# Altium project gittest23_2.PrjPcb
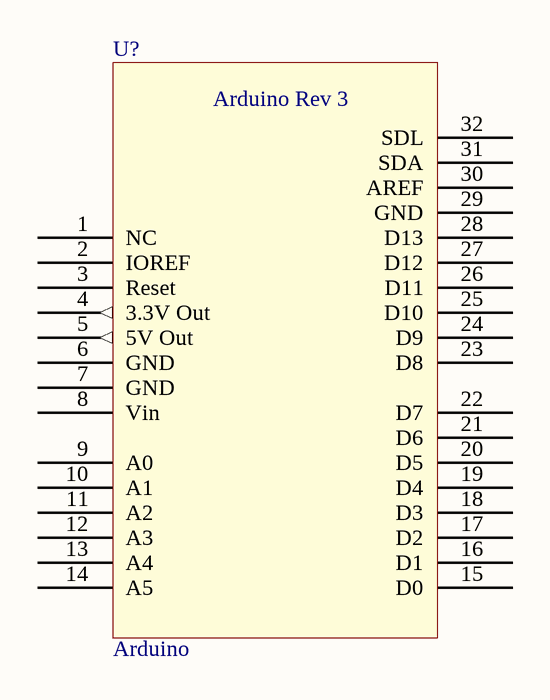
[diagram p0: gittest23_2.SchDoc]
1 sheet, 1 parts. Net scope: global (net labels, ports and power ports of the same name join across sheets).

## Sheet gittest23_2.SchDoc
size D; SheetNumber: 1; SheetTotal: 1

### Parts
U?  Arduino  [Arduino]

### Nets

Not connected (* = marked no-connect by the designer): U? 1(NC) 2(IOREF) 3(Reset) 4(3.3V_Out) 5(5V_Out) 6(GND) 7(GND) 8(Vin) 9(A0) 10(A1) 11(A2) 12(A3) 13(A4) 14(A5) 15(D0) 16(D1) 17(D2) 18(D3) 19(D4) 20(D5) 21(D6) 22(D7) 23(D8) 24(D9) 25(D10) 26(D11) 27(D12) 28(D13) 29(GND) 30(AREF) 31(SDA) 32(SDL)

### Notes on the sheet
- (in symbol Arduino) Arduino Rev 3